# Altium schematic sheet WIZ850io_SCH_V100.SchDoc (part 2 of 3)
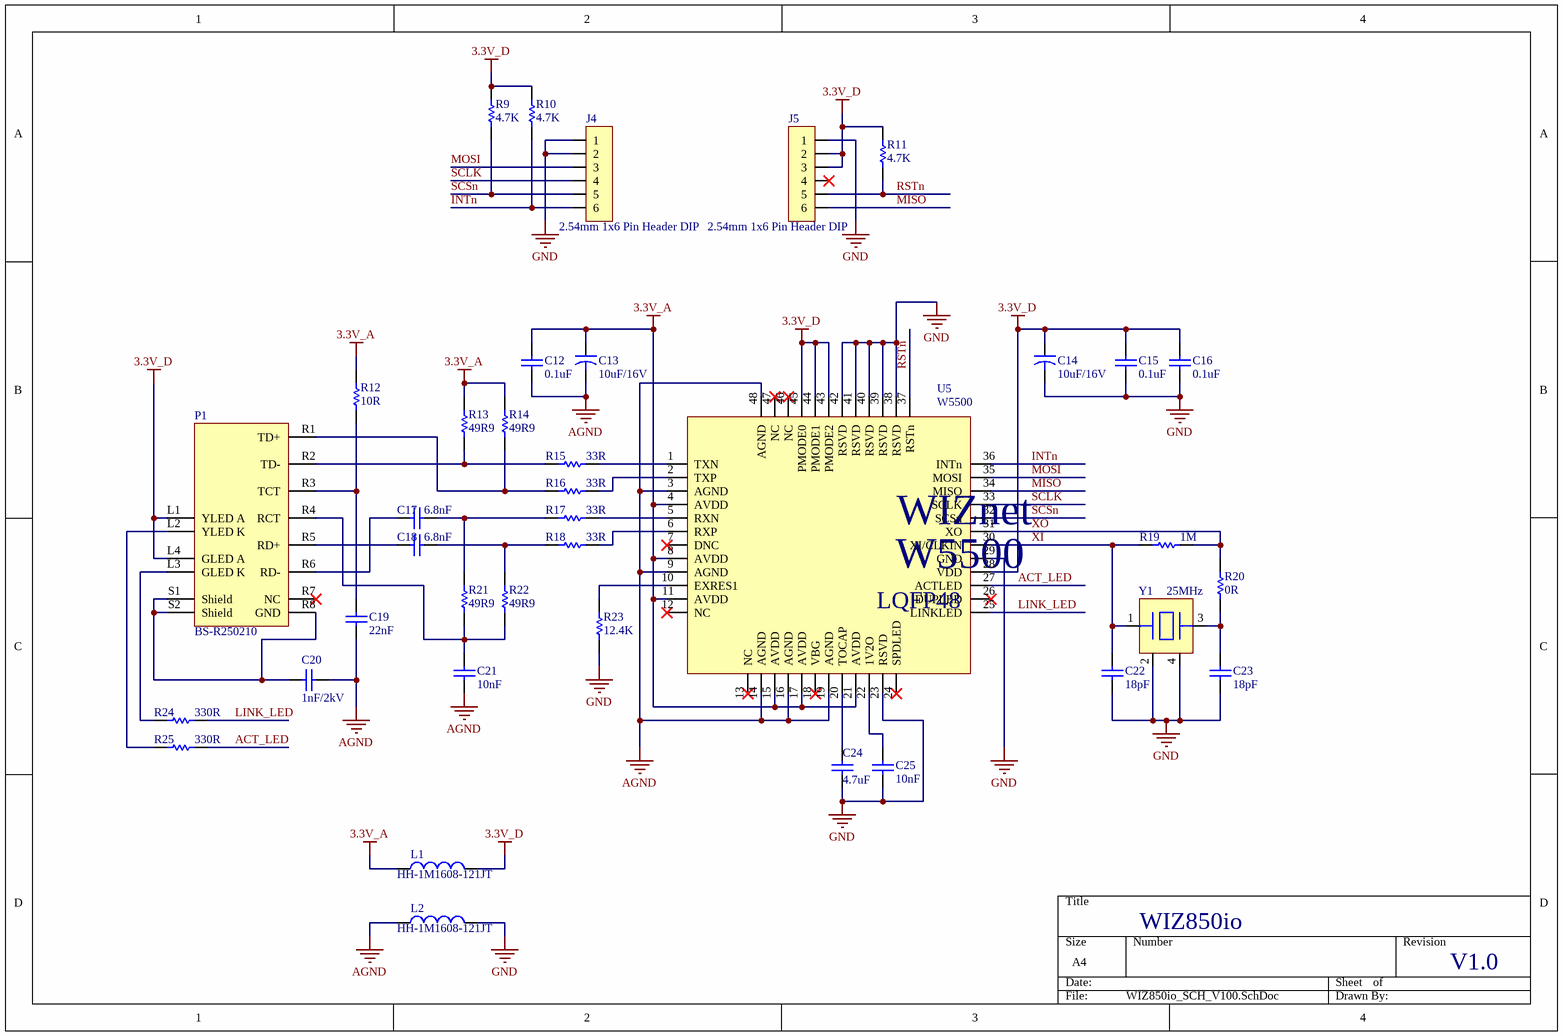
[diagram p1: WIZ850io_SCH_V100.SchDoc]
## Library data of the parts
C12 C15 C16 = CAP-0402: CAP CER 0.1UF 25V X7R 0603; Manufacturer: Kyocera AVX; Manufacturer Part Number: 06033C104JAT2A; Dielectric Material: Ceramic; Capacitance: 100nF; Tolerance: 5%; Supplier 1: Digi-Key; Supplier Part Number 1: 478-3713-1-ND; RoHS: Yes; Category: Ceramic Capacitors; Stock 1: 348868; Pricing 1: 1=0.33000, 10=0.23100, 50=0.16180, 100=0.13870, 500=0.10400, 1000=0.08782 (USD); Mount: Surface Mount,PCB,Through Hole; Case/Package: 0603; Number of Pins: 2; Case Code (Metric): 1608; Case Code (Imperial): 0603; Contact Plating: Tin,Matte; Min Operating Temperature: -55°C; Max Operating Temperature: 125°C; Voltage Rating: 25V; Packaging: Tape and Reel; Package Quantity: 1; Dielectric: X7R; Termination: SMD/SMT; Voltage Rating (DC): 25V; Voltage: 25V; Length: 1.6mm; Height: 0.9mm; Width: 0.032inch; Thickness: 0.035inch; Depth: 0.81mm; Lead Pitch: 5.08mm; Radiation Hardening: No; REACH SVHC: No SVHC; Lead Free: Lead Free; ComponentLink1URL: https://datasheet.ciiva.com/208/cx7r-208464.pdf?src-supplier=Digi-Key; ComponentLink1Description: https://datasheet.ciiva.com/208/cx7r-208464.pdf?src-supplier=Digi-Key; ComponentLink2URL: https://datasheet.ciiva.com/208/cx7r-208465.pdf?src-supplier=Digi-Key; ComponentLink2Description: https://datasheet.ciiva.com/208/cx7r-208465.pdf?src-supplier=Digi-Key; ComponentLink3URL: https://datasheet.ciiva.com/1124/1679506-1124547.pdf?src-supplier=Element14; ComponentLink3Description: https://datasheet.ciiva.com/1124/1679506-1124547.pdf?src-supplier=Element14; ComponentLink4URL: https://datasheet.ciiva.com/1124/1679506-1124548.pdf?src-supplier=Element14; ComponentLink4Description: https://datasheet.ciiva.com/1124/1679506-1124548.pdf?src-supplier=Element14; ComponentLink5URL: https://datasheet.ciiva.com/5423/cx7r-218113-5423653.pdf?src-supplier=Mouser; ComponentLink5Description: https://datasheet.ciiva.com/5423/cx7r-218113-5423653.pdf?src-supplier=Mouser; ComponentLink6URL: https://datasheet.ciiva.com/7855/1679506-7855045.pdf?src-supplier=Element14; ComponentLink6Description: https://datasheet.ciiva.com/7855/1679506-7855045.pdf?src-supplier=Element14; ComponentLink7URL: https://datasheet.ciiva.com/15165/getdatasheetpartid-33578-15165094.pdf?src-supplier=Verical; ComponentLink7Description: https://datasheet.ciiva.com/15165/getdatasheetpartid-33578-15165094.pdf?src-supplier=Verical; ComponentLink8URL: https://datasheet.ciiva.com/2987/cx7r-2987753.pdf?src-supplier=Avnet; ComponentLink8Description: https://datasheet.ciiva.com/2987/cx7r-2987753.pdf?src-supplier=Avnet; ComponentLink9URL: https://datasheet.ciiva.com/14595/70001075-14595082.pdf?src-supplier=Allied+Electronics; ComponentLink9Description: https://datasheet.ciiva.com/14595/70001075-14595082.pdf?src-supplier=Allied+Electronics; ComponentLink10URL: https://datasheet.ciiva.com/14590/70001075-14590332.pdf?src-supplier=Allied+Electronics; ComponentLink10Description: https://datasheet.ciiva.com/14590/70001075-14590332.pdf?src-supplier=Allied+Electronics; ComponentLink11URL: https://datasheet.ciiva.com/208/cx7r-208463.pdf?src-supplier=Digi-Key; ComponentLink11Description: https://datasheet.ciiva.com/208/cx7r-208463.pdf?src-supplier=Digi-Key
C13 C14 = CAP-A Size: Cap Ceramic 10uF 16V X5R 20% SMD 0603 85°C Paper T/R; Manufacturer: Taiyo Yuden; Manufacturer Part Number: EMK107BBJ106MA-T; Supplier 1: Digi-Key; Supplier Part Number 1: 587-3238-6-ND; RoHS: Yes; Category: Ceramic Capacitors; Stock 1: 797251; Pricing 1: 1=0.37000, 10=0.25800, 50=0.18040, 100=0.15460, 500=0.11598, 1000=0.09794 (USD); Mount: Surface Mount; Case/Package: 0603; Case Code (Metric): 1608; Case Code (Imperial): 0603; Min Operating Temperature: -55°C; Max Operating Temperature: 85°C; Tolerance: 20%; Packaging: Tape and Reel; Capacitance: 10uF; Voltage Rating: 16V; Package Quantity: 1; Dielectric: X5R; Voltage Rating (DC): 16V; Termination: SMD/SMT; Length: 0.063inch; Height: 0.8mm; Width: 0.031inch; Thickness: 0.031inch; REACH SVHC: Unknown; Halogen Free: Halogen Free; ComponentLink1URL: https://datasheet.ciiva.com/6259/emk107bbj106ma-t-6259169.pdf?src-supplier=Digi-Key; ComponentLink1Description: https://datasheet.ciiva.com/6259/emk107bbj106ma-t-6259169.pdf?src-supplier=Digi-Key; ComponentLink2URL: https://datasheet.ciiva.com/15920/3emk107bbj106ma-t-15920482.pdf?src-supplier=Onlinecomponents.com; ComponentLink2Description: https://datasheet.ciiva.com/15920/3emk107bbj106ma-t-15920482.pdf?src-supplier=Onlinecomponents.com; ComponentLink3URL: https://datasheet.ciiva.com/34372/463emk107bbj106ma-t-34372674.pdf?src-supplier=Onlinecomponents.com; ComponentLink3Description: https://datasheet.ciiva.com/34372/463emk107bbj106ma-t-34372674.pdf?src-supplier=Onlinecomponents.com; ComponentLink4URL: https://datasheet.ciiva.com/6259/emk107bbj106ma-t-6259164.pdf?src-supplier=Digi-Key; ComponentLink4Description: https://datasheet.ciiva.com/6259/emk107bbj106ma-t-6259164.pdf?src-supplier=Digi-Key; ComponentLink5URL: https://datasheet.ciiva.com/6259/emk107bbj106ma-t-6259167.pdf?src-supplier=Digi-Key; ComponentLink5Description: https://datasheet.ciiva.com/6259/emk107bbj106ma-t-6259167.pdf?src-supplier=Digi-Key; ComponentLink6URL: https://datasheet.ciiva.com/13168/mlcc01-e-13168735.pdf?src-supplier=Mouser; ComponentLink6Description: https://datasheet.ciiva.com/13168/mlcc01-e-13168735.pdf?src-supplier=Mouser
C17 C18 = CAP-0402: AVX - 06031C682KAT2A - SMD Multilayer Ceramic Capacitor, 6800 pF, 100 V, 0603 [1608 Metric], ± 10%, X7R, AVX 0603 MLCC; Manufacturer: Kyocera AVX; Voltage Rating (DC): 100V; Dissipation Factor: 2.5%; Supplier 1: Digi-Key; Supplier Part Number 1: 478-1204-1-ND; Manufacturer Part Number: 06031C682KAT2A; RoHS: Yes; Category: Ceramic Capacitors; Stock 1: 9488; Pricing 1: 1=0.25000, 10=0.17200, 50=0.10340, 100=0.08740, 500=0.05978, 1000=0.05288 (USD); Mount: Surface Mount,PCB; Case/Package: 0603; Number of Pins: 2; Case Code (Metric): 1608; Case Code (Imperial): 0603; Contact Plating: Tin,Matte; Min Operating Temperature: -55°C; Max Operating Temperature: 125°C; Capacitance: 6.8nF; Tolerance: 10%; Packaging: Tape and Reel; Dielectric: X7R; Voltage Rating: 100V; Termination: SMD/SMT; Package Quantity: 1; Voltage: 100V; Length: 1.6mm; Height: 0.9mm; Width: 0.032inch; Depth: 0.81mm; Thickness: 0.035inch; Radiation Hardening: No; Lead Free: Lead Free; REACH SVHC: No SVHC; ComponentLink1URL: https://datasheet.ciiva.com/11788/0900766b80dc2409-11788556.pdf?src-supplier=RSComponents; ComponentLink1Description: https://datasheet.ciiva.com/11788/0900766b80dc2409-11788556.pdf?src-supplier=RSComponents; ComponentLink2URL: https://datasheet.ciiva.com/151/cx7r-151121.pdf?src-supplier=Digi-Key; ComponentLink2Description: https://datasheet.ciiva.com/151/cx7r-151121.pdf?src-supplier=Digi-Key; ComponentLink3URL: https://datasheet.ciiva.com/151/cx7r-151122.pdf?src-supplier=Digi-Key; ComponentLink3Description: https://datasheet.ciiva.com/151/cx7r-151122.pdf?src-supplier=Digi-Key; ComponentLink4URL: https://datasheet.ciiva.com/151/cx7r-151123.pdf?src-supplier=Digi-Key; ComponentLink4Description: https://datasheet.ciiva.com/151/cx7r-151123.pdf?src-supplier=Digi-Key; ComponentLink5URL: https://datasheet.ciiva.com/5417/cx7r-218113-5417925.pdf?src-supplier=Mouser; ComponentLink5Description: https://datasheet.ciiva.com/5417/cx7r-218113-5417925.pdf?src-supplier=Mouser; ComponentLink6URL: https://datasheet.ciiva.com/17489/cx7r-17489445.pdf?src-supplier=Avnet+Europe; ComponentLink6Description: https://datasheet.ciiva.com/17489/cx7r-17489445.pdf?src-supplier=Avnet+Europe; ComponentLink7URL: https://datasheet.ciiva.com/11577/cx7r-11577894.pdf?src-supplier=Avnet; ComponentLink7Description: https://datasheet.ciiva.com/11577/cx7r-11577894.pdf?src-supplier=Avnet; ComponentLink8URL: https://datasheet.ciiva.com/16484/cx7r-16484406.pdf?src-supplier=Avnet+Asia; ComponentLink8Description: https://datasheet.ciiva.com/16484/cx7r-16484406.pdf?src-supplier=Avnet+Asia; ComponentLink9URL: https://datasheet.ciiva.com/1124/1679506-1124359.pdf?src-supplier=Element14; ComponentLink9Description: https://datasheet.ciiva.com/1124/1679506-1124359.pdf?src-supplier=Element14; ComponentLink10URL: https://datasheet.ciiva.com/1124/1679506-1124360.pdf?src-supplier=Element14; ComponentLink10Description: https://datasheet.ciiva.com/1124/1679506-1124360.pdf?src-supplier=Element14; ComponentLink11URL: https://datasheet.ciiva.com/14595/70001075-14595998.pdf?src-supplier=Allied+Electronics; ComponentLink11Description: https://datasheet.ciiva.com/14595/70001075-14595998.pdf?src-supplier=Allied+Electronics; ComponentLink12URL: https://datasheet.ciiva.com/16395/cx7r-16395935.pdf?src-supplier=Future+Electronics; ComponentLink12Description: https://datasheet.ciiva.com/16395/cx7r-16395935.pdf?src-supplier=Future+Electronics
C19 = CAP-0402: Cap Ceramic 0.022uF 25V X7R 10% SMD 0603 125°C Paper T/R; Manufacturer: Kyocera AVX; Manufacturer Part Number: 06033C223KAT2A; Supplier 1: Digi-Key; Supplier Part Number 1: 478-5896-1-ND; RoHS: Yes; Category: Ceramic Capacitors; Stock 1: 466; Pricing 1: 1=0.12000, 10=0.08500, 50=0.04820, 100=0.04000, 500=0.02804, 1000=0.02322 (USD); Mount: Surface Mount; Case/Package: 0603; Number of Pins: 2; Case Code (Imperial): 0603; Case Code (Metric): 1608; Dielectric Material: Ceramic; Contact Plating: Tin,Matte; Min Operating Temperature: -55°C; Max Operating Temperature: 125°C; Capacitance: 22nF; Tolerance: 10%; Voltage Rating: 25V; Dielectric: X7R; Packaging: Tape and Reel; Voltage Rating (DC): 25V; Termination: SMD/SMT; Package Quantity: 1; Voltage: 25V; Length: 1.6mm; Height: 0.9mm; Width: 0.032inch; Depth: 0.81mm; Thickness: 0.035inch; Radiation Hardening: No; Lead Free: Lead Free; REACH SVHC: Unknown; ComponentLink1URL: https://datasheet.ciiva.com/11787/0900766b802d4698-11787397.pdf?src-supplier=RSComponents; ComponentLink1Description: https://datasheet.ciiva.com/11787/0900766b802d4698-11787397.pdf?src-supplier=RSComponents; ComponentLink2URL: https://datasheet.ciiva.com/1124/1679506-1124596.pdf?src-supplier=Element14; ComponentLink2Description: https://datasheet.ciiva.com/1124/1679506-1124596.pdf?src-supplier=Element14; ComponentLink3URL: https://datasheet.ciiva.com/1124/1679506-1124597.pdf?src-supplier=Element14; ComponentLink3Description: https://datasheet.ciiva.com/1124/1679506-1124597.pdf?src-supplier=Element14; ComponentLink4URL: https://datasheet.ciiva.com/7855/1679506-7855047.pdf?src-supplier=Element14; ComponentLink4Description: https://datasheet.ciiva.com/7855/1679506-7855047.pdf?src-supplier=Element14; ComponentLink5URL: https://datasheet.ciiva.com/5419/cx7r-5419880.pdf?src-supplier=Mouser; ComponentLink5Description: https://datasheet.ciiva.com/5419/cx7r-5419880.pdf?src-supplier=Mouser; ComponentLink6URL: https://datasheet.ciiva.com/161/cx7r-161997.pdf?src-supplier=Digi-Key; ComponentLink6Description: https://datasheet.ciiva.com/161/cx7r-161997.pdf?src-supplier=Digi-Key; ComponentLink7URL: https://datasheet.ciiva.com/161/cx7r-161998.pdf?src-supplier=Digi-Key; ComponentLink7Description: https://datasheet.ciiva.com/161/cx7r-161998.pdf?src-supplier=Digi-Key; ComponentLink8URL: https://datasheet.ciiva.com/16225/cx7r-16225742.pdf?src-supplier=Future+Electronics; ComponentLink8Description: https://datasheet.ciiva.com/16225/cx7r-16225742.pdf?src-supplier=Future+Electronics; ComponentLink9URL: https://datasheet.ciiva.com/161/cx7r-161999.pdf?src-supplier=Digi-Key; ComponentLink9Description: https://datasheet.ciiva.com/161/cx7r-161999.pdf?src-supplier=Digi-Key
C20 = CAP-1808: Cap Ceramic 0.001uF 50V X7R 10% SMD 0603 125C Paper T/R; Manufacturer: Kyocera AVX; Manufacturer Part Number: 06035C102KAT2A; Capacitance: 1nF; Supplier 1: Digi-Key; Supplier Part Number 1: 478-1215-1-ND; RoHS: Yes; Category: Ceramic Capacitors; Stock 1: 1212280; Pricing 1: 1=0.10000, 10=0.06100, 50=0.03340, 100=0.02730, 500=0.01948, 1000=0.01531 (USD); Mount: Surface Mount,PCB; Case/Package: 0603; Number of Pins: 2; Weight: 7.1E-05oz; Case Code (Imperial): 0603; Case Code (Metric): 1608; Dielectric Material: Ceramic; Contact Plating: Tin,Matte; Min Operating Temperature: -55°C; Max Operating Temperature: 125°C; Tolerance: 10%; Voltage Rating: 50V; Packaging: Tape and Reel; Dielectric: X7R; Voltage Rating (DC): 50V; Package Quantity: 4000; Termination: SMD/SMT; Voltage: 50V; Length: 1.6mm; Height: 0.9mm; Width: 0.81mm; Thickness: 0.035inch; Depth: 0.81mm; Radiation Hardening: No; REACH SVHC: No SVHC; Lead Free: Lead Free; ComponentLink1URL: https://datasheet.ciiva.com/11787/0900766b802d4698-11787050.pdf?src-supplier=RSComponents; ComponentLink1Description: https://datasheet.ciiva.com/11787/0900766b802d4698-11787050.pdf?src-supplier=RSComponents; ComponentLink2URL: https://datasheet.ciiva.com/1124/1679506-1124840.pdf?src-supplier=Element14; ComponentLink2Description: https://datasheet.ciiva.com/1124/1679506-1124840.pdf?src-supplier=Element14; ComponentLink3URL: https://datasheet.ciiva.com/7855/1679506-7855080.pdf?src-supplier=Element14; ComponentLink3Description: https://datasheet.ciiva.com/7855/1679506-7855080.pdf?src-supplier=Element14; ComponentLink4URL: https://datasheet.ciiva.com/2987/cx7r-2987820.pdf?src-supplier=Avnet; ComponentLink4Description: https://datasheet.ciiva.com/2987/cx7r-2987820.pdf?src-supplier=Avnet; ComponentLink5URL: https://datasheet.ciiva.com/150/cx7r-150237.pdf?src-supplier=Digi-Key; ComponentLink5Description: https://datasheet.ciiva.com/150/cx7r-150237.pdf?src-supplier=Digi-Key; ComponentLink6URL: https://datasheet.ciiva.com/16327/cx7r-16327069.pdf?src-supplier=Future+Electronics; ComponentLink6Description: https://datasheet.ciiva.com/16327/cx7r-16327069.pdf?src-supplier=Future+Electronics; ComponentLink7URL: https://datasheet.ciiva.com/16538/cx7r-16538173.pdf?src-supplier=Avnet+Asia; ComponentLink7Description: https://datasheet.ciiva.com/16538/cx7r-16538173.pdf?src-supplier=Avnet+Asia; ComponentLink8URL: https://datasheet.ciiva.com/1124/1679506-1124839.pdf?src-supplier=Element14; ComponentLink8Description: https://datasheet.ciiva.com/1124/1679506-1124839.pdf?src-supplier=Element14; ComponentLink9URL: https://datasheet.ciiva.com/14595/70001075-14595287.pdf?src-supplier=Allied+Electronics; ComponentLink9Description: https://datasheet.ciiva.com/14595/70001075-14595287.pdf?src-supplier=Allied+Electronics; ComponentLink10URL: https://datasheet.ciiva.com/2987/cx7r-2987819.pdf?src-supplier=Avnet; ComponentLink10Description: https://datasheet.ciiva.com/2987/cx7r-2987819.pdf?src-supplier=Avnet; ComponentLink11URL: https://datasheet.ciiva.com/150/cx7r-150236.pdf?src-supplier=Digi-Key; ComponentLink11Description: https://datasheet.ciiva.com/150/cx7r-150236.pdf?src-supplier=Digi-Key; ComponentLink12URL: https://datasheet.ciiva.com/150/cx7r-150238.pdf?src-supplier=Digi-Key; ComponentLink12Description: https://datasheet.ciiva.com/150/cx7r-150238.pdf?src-supplier=Digi-Key
C21 = CAP-0402: 0603 10nF 50 V ±10 % Tolerance X7R Surface Mount Multilayer Ceramic Capacitor; Manufacturer: Kyocera AVX; Manufacturer Part Number: 06035C103KAT2A; Tolerance: 10%; Voltage Rating (DC): 50V; Dissipation Factor: 2.5%; Insulation Resistance: 100GR; Supplier 1: Digi-Key; Supplier Part Number 1: 478-1227-1-ND; RoHS: Yes; Category: Ceramic Capacitors; Stock 1: 9754114; Pricing 1: 1=0.10000, 10=0.04300, 50=0.02320, 100=0.01900, 500=0.01356, 1000=0.01065 (USD); Mount: Surface Mount,PCB; Case/Package: 0603; Number of Pins: 2; Case Code (Metric): 1608; Case Code (Imperial): 0603; Dielectric Material: Ceramic; Contact Plating: Tin,Matte; Min Operating Temperature: -55°C; Max Operating Temperature: 125°C; Capacitance: 10nF; Dielectric: X7R; Voltage Rating: 50V; Packaging: Tape and Reel; Package Quantity: 1; Termination: SMD/SMT; Voltage: 50V; Length: 1.6mm; Height: 0.9mm; Width: 0.032inch; Depth: 0.81mm; Thickness: 0.035inch; Radiation Hardening: No; Lead Free: Lead Free; REACH SVHC: No SVHC; ComponentLink1URL: https://datasheet.ciiva.com/1124/1679506-1124848.pdf?src-supplier=Element14; ComponentLink1Description: https://datasheet.ciiva.com/1124/1679506-1124848.pdf?src-supplier=Element14; ComponentLink2URL: https://datasheet.ciiva.com/150/cx7r-150227.pdf?src-supplier=Digi-Key; ComponentLink2Description: https://datasheet.ciiva.com/150/cx7r-150227.pdf?src-supplier=Digi-Key; ComponentLink3URL: https://datasheet.ciiva.com/2987/cx7r-2987824.pdf?src-supplier=Avnet; ComponentLink3Description: https://datasheet.ciiva.com/2987/cx7r-2987824.pdf?src-supplier=Avnet; ComponentLink4URL: https://datasheet.ciiva.com/150/cx7r-150229.pdf?src-supplier=Digi-Key; ComponentLink4Description: https://datasheet.ciiva.com/150/cx7r-150229.pdf?src-supplier=Digi-Key; ComponentLink5URL: https://datasheet.ciiva.com/7855/1679506-7855082.pdf?src-supplier=Element14; ComponentLink5Description: https://datasheet.ciiva.com/7855/1679506-7855082.pdf?src-supplier=Element14
C22 C23 = CAP-0402: AVX - 06031A180JAT2A - SMD Multilayer Ceramic Capacitor, 18 pF, 100 V, 0603 [1608 Metric], ± 5%, C0G / NP0; Manufacturer: Kyocera AVX; Voltage Rating: 100V; Temperature Coefficient: 30ppm/°C; Insulation Resistance: 100GR; Supplier 1: Digi-Key; Supplier Part Number 1: 478-4982-1-ND; Manufacturer Part Number: 06031A180JAT2A; RoHS: Yes; Category: Ceramic Capacitors; Stock 1: 6208; Pricing 1: 1=0.17000, 10=0.12300, 50=0.06980, 100=0.05790, 500=0.04060, 1000=0.03361 (USD); Mount: Surface Mount,PCB; Case/Package: 0603; Number of Pins: 2; Case Code (Metric): 1608; Case Code (Imperial): 0603; Dielectric Material: Ceramic; Contact Plating: Tin,Matte; Min Operating Temperature: -55°C; Max Operating Temperature: 125°C; Capacitance: 18pF; Tolerance: 5%; Packaging: Tape and Reel; Dielectric: C0G; Package Quantity: 4000; Voltage Rating (DC): 100V; Termination: SMD/SMT; Voltage: 100V; Length: 1.6mm; Height: 0.9mm; Width: 0.032inch; Depth: 0.81mm; Thickness: 0.035inch; Radiation Hardening: No; Lead Free: Lead Free; REACH SVHC: No SVHC; ComponentLink1URL: https://datasheet.ciiva.com/150/ccog-150800.pdf?src-supplier=Digi-Key; ComponentLink1Description: https://datasheet.ciiva.com/150/ccog-150800.pdf?src-supplier=Digi-Key; ComponentLink2URL: https://datasheet.ciiva.com/1124/759117-1124128.pdf?src-supplier=Element14; ComponentLink2Description: https://datasheet.ciiva.com/1124/759117-1124128.pdf?src-supplier=Element14; ComponentLink3URL: https://datasheet.ciiva.com/150/ccog-150801.pdf?src-supplier=Digi-Key; ComponentLink3Description: https://datasheet.ciiva.com/150/ccog-150801.pdf?src-supplier=Digi-Key; ComponentLink4URL: https://datasheet.ciiva.com/150/ccog-150802.pdf?src-supplier=Digi-Key; ComponentLink4Description: https://datasheet.ciiva.com/150/ccog-150802.pdf?src-supplier=Digi-Key; ComponentLink5URL: https://datasheet.ciiva.com/16297/ccog-16297640.pdf?src-supplier=Future+Electronics; ComponentLink5Description: https://datasheet.ciiva.com/16297/ccog-16297640.pdf?src-supplier=Future+Electronics; ComponentLink6URL: https://datasheet.ciiva.com/11499/ccog-11499641.pdf?src-supplier=Avnet; ComponentLink6Description: https://datasheet.ciiva.com/11499/ccog-11499641.pdf?src-supplier=Avnet; ComponentLink7URL: https://datasheet.ciiva.com/5414/ccog-5414522.pdf?src-supplier=Mouser; ComponentLink7Description: https://datasheet.ciiva.com/5414/ccog-5414522.pdf?src-supplier=Mouser; ComponentLink8URL: https://datasheet.ciiva.com/1124/759117-1124127.pdf?src-supplier=Element14; ComponentLink8Description: https://datasheet.ciiva.com/1124/759117-1124127.pdf?src-supplier=Element14; ComponentLink9URL: https://datasheet.ciiva.com/28689/759117-28689519.pdf?src-supplier=Element14; ComponentLink9Description: https://datasheet.ciiva.com/28689/759117-28689519.pdf?src-supplier=Element14
C24 = CAP-0402: Ceramic CAP 0402(1005)
C25 = CAP-0805: 0603 10nF 50 V ±10 % Tolerance X7R Surface Mount Multilayer Ceramic Capacitor; Manufacturer: Kyocera AVX; Manufacturer Part Number: 06035C103KAT2A; Tolerance: 10%; Voltage Rating (DC): 50V; Dissipation Factor: 2.5%; Insulation Resistance: 100GR; Supplier 1: Digi-Key; Supplier Part Number 1: 478-1227-1-ND; RoHS: Yes; Category: Ceramic Capacitors; Stock 1: 9754114; Pricing 1: 1=0.10000, 10=0.04300, 50=0.02320, 100=0.01900, 500=0.01356, 1000=0.01065 (USD); Mount: Surface Mount,PCB; Case/Package: 0603; Number of Pins: 2; Case Code (Metric): 1608; Case Code (Imperial): 0603; Dielectric Material: Ceramic; Contact Plating: Tin,Matte; Min Operating Temperature: -55°C; Max Operating Temperature: 125°C; Capacitance: 10nF; Dielectric: X7R; Voltage Rating: 50V; Packaging: Tape and Reel; Package Quantity: 1; Termination: SMD/SMT; Voltage: 50V; Length: 1.6mm; Height: 0.9mm; Width: 0.032inch; Depth: 0.81mm; Thickness: 0.035inch; Radiation Hardening: No; Lead Free: Lead Free; REACH SVHC: No SVHC; ComponentLink1URL: https://datasheet.ciiva.com/1124/1679506-1124848.pdf?src-supplier=Element14; ComponentLink1Description: https://datasheet.ciiva.com/1124/1679506-1124848.pdf?src-supplier=Element14; ComponentLink2URL: https://datasheet.ciiva.com/2987/cx7r-2987824.pdf?src-supplier=Avnet; ComponentLink2Description: https://datasheet.ciiva.com/2987/cx7r-2987824.pdf?src-supplier=Avnet; ComponentLink3URL: https://datasheet.ciiva.com/150/cx7r-150227.pdf?src-supplier=Digi-Key; ComponentLink3Description: https://datasheet.ciiva.com/150/cx7r-150227.pdf?src-supplier=Digi-Key; ComponentLink4URL: https://datasheet.ciiva.com/150/cx7r-150229.pdf?src-supplier=Digi-Key; ComponentLink4Description: https://datasheet.ciiva.com/150/cx7r-150229.pdf?src-supplier=Digi-Key; ComponentLink5URL: https://datasheet.ciiva.com/7855/1679506-7855082.pdf?src-supplier=Element14; ComponentLink5Description: https://datasheet.ciiva.com/7855/1679506-7855082.pdf?src-supplier=Element14
L1 L2 = IND-0603: Inductor 0603(1608)
R9 R10 = RES-0402: SMD Resistor, Thick film 4.7 kOhm,  ±  1 %, 0603, CRCW06034K70FKEA, Vishay; Manufacturer: Vishay Dale; Manufacturer Part Number: CRA06S0434K70JTA; Resistance: 4.7kR; Tolerance: 5%; Number of Contacts: 4; Voltage Rating (DC): 50V; Circuit Type: Isolated; Number of Resistors: 2; Power Per Element: 62.5mW; Temperature Coefficient: 200ppm/°C; Power Rating: 100mW; Voltage Rating: 75V; Supplier 1: Arrow; Supplier Part Number 1: CRA06S0434K70JTA; RoHS: Yes; Category: Resistor Arrays; Mount: Surface Mount; Case/Package: SMD/SMT; Number of Pins: 4; Case Code (Metric): 1615; Contact Plating: Tin; Case Code (Imperial): 0605; Min Operating Temperature: -55°C; Max Operating Temperature: 155°C; Packaging: Tape and Reel; Package Quantity: 5000; Termination: SMD/SMT; Length: 1.6mm; Height: 0.024inch; Width: 0.059inch; Thickness: 500um; Terminal Pitch: 0.8mm; Lead Pitch: 0.8mm; Lead Free: Exempt; ComponentLink1URL: https://datasheet.ciiva.com/2697/cra06es-2697298.pdf?src-supplier=Digi-Key; ComponentLink1Description: https://datasheet.ciiva.com/2697/cra06es-2697298.pdf?src-supplier=Digi-Key; ComponentLink2URL: https://datasheet.ciiva.com/2697/cra06es-2697299.pdf?src-supplier=Digi-Key; ComponentLink2Description: https://datasheet.ciiva.com/2697/cra06es-2697299.pdf?src-supplier=Digi-Key; ComponentLink3URL: https://datasheet.ciiva.com/2697/cra06es-2697300.pdf?src-supplier=Digi-Key; ComponentLink3Description: https://datasheet.ciiva.com/2697/cra06es-2697300.pdf?src-supplier=Digi-Key; Supplier 2: Digi-Key; Supplier Part Number 2: 541-4.70KHCT-ND; Stock 2: 40363; Pricing 2: 1=0.10000, 10=0.03400, 100=0.01390, 1000=0.00623, 2500=0.00540 (USD); Weight: 7.1E-05oz; Composition: Thick Film; Military Standard: Not; Depth: 0.85mm; REACH SVHC: Unknown; ComponentLink4URL: https://datasheet.ciiva.com/11809/0900766b80d98afc-11809859.pdf?src-supplier=RSComponents; ComponentLink4Description: https://datasheet.ciiva.com/11809/0900766b80d98afc-11809859.pdf?src-supplier=RSComponents; ComponentLink5URL: https://datasheet.ciiva.com/16199/dcrcwe3-16199366.pdf?src-supplier=Future+Electronics; ComponentLink5Description: https://datasheet.ciiva.com/16199/dcrcwe3-16199366.pdf?src-supplier=Future+Electronics; ComponentLink6URL: https://datasheet.ciiva.com/16764/70201119-16764918.pdf?src-supplier=Allied+Electronics; ComponentLink6Description: https://datasheet.ciiva.com/16764/70201119-16764918.pdf?src-supplier=Allied+Electronics; ComponentLink7URL: https://datasheet.ciiva.com/16520/dcrcwe3-16520616.pdf?src-supplier=Avnet+Asia; ComponentLink7Description: https://datasheet.ciiva.com/16520/dcrcwe3-16520616.pdf?src-supplier=Avnet+Asia; ComponentLink8URL: https://datasheet.ciiva.com/15159/getdatasheetpartid-33073-15159382.pdf?src-supplier=Verical; ComponentLink8Description: https://datasheet.ciiva.com/15159/getdatasheetpartid-33073-15159382.pdf?src-supplier=Verical; ComponentLink9URL: https://datasheet.ciiva.com/16724/70201119-16724106.pdf?src-supplier=Allied+Electronics; ComponentLink9Description: https://datasheet.ciiva.com/16724/70201119-16724106.pdf?src-supplier=Allied+Electronics; ComponentLink10URL: https://datasheet.ciiva.com/8079/1697337-8079646.pdf?src-supplier=Element14; ComponentLink10Description: https://datasheet.ciiva.com/8079/1697337-8079646.pdf?src-supplier=Element14; ComponentLink11URL: https://datasheet.ciiva.com/26314/fld-crcw-e3-data-en-26314735.pdf?src-supplier=Distrelec; ComponentLink11Description: https://datasheet.ciiva.com/26314/fld-crcw-e3-data-en-26314735.pdf?src-supplier=Distrelec
R11 = RES-0402: SMD Resistor, Thick film 4.7 kOhm,  ±  1 %, 0603, CRCW06034K70FKEA, Vishay; Manufacturer Part Number: CRCW12064K70FKEA; Tolerance: 1%; Resistance: 4.7kR; Power Rating: 250mW; Voltage Rating: 200V; Temperature Coefficient: 100ppm/°C; Supplier 1: Digi-Key; Supplier Part Number 1: 541-4.70KFCT-ND; Manufacturer: Vishay; RoHS: Yes; Category: Chip SMD Resistors; Stock 1: 168936; Pricing 1: 1=0.10000, 10=0.07600, 100=0.02930, 1000=0.01287, 2500=0.01112 (USD); Mount: Surface Mount; Case/Package: 1206; Weight: 0.000353oz; Case Code (Imperial): 1206; Case Code (Metric): 3216; Contact Plating: Tin; Min Operating Temperature: -55°C; Max Operating Temperature: 155°C; Packaging: Tape and Reel; Composition: Thick Film; Military Standard: Not; Package Quantity: 10; Termination: SMD/SMT; Voltage Rating (DC): 200V; Number of Terminations: 2; Max Power Dissipation: 250mW; Features: Automotive AEC-Q200; Length: 3.2mm; Height: 0.55mm; Width: 1.6mm; Depth: 1.6mm; Radiation Hardening: No; REACH SVHC: Unknown; Lead Free: Lead Free; ComponentLink1URL: https://datasheet.ciiva.com/11809/0900766b80d98b5e-11809114.pdf?src-supplier=RSComponents; ComponentLink1Description: https://datasheet.ciiva.com/11809/0900766b80d98b5e-11809114.pdf?src-supplier=RSComponents; ComponentLink2URL: https://datasheet.ciiva.com/8079/1720486-8079670.pdf?src-supplier=Element14; ComponentLink2Description: https://datasheet.ciiva.com/8079/1720486-8079670.pdf?src-supplier=Element14; ComponentLink3URL: https://datasheet.ciiva.com/16724/70201119-16724102.pdf?src-supplier=Allied+Electronics; ComponentLink3Description: https://datasheet.ciiva.com/16724/70201119-16724102.pdf?src-supplier=Allied+Electronics; ComponentLink4URL: https://datasheet.ciiva.com/8079/1697337-8079656.pdf?src-supplier=Element14; ComponentLink4Description: https://datasheet.ciiva.com/8079/1697337-8079656.pdf?src-supplier=Element14; ComponentLink5URL: https://datasheet.ciiva.com/9071/dcrcwe3-9071209.pdf?src-supplier=Avnet; ComponentLink5Description: https://datasheet.ciiva.com/9071/dcrcwe3-9071209.pdf?src-supplier=Avnet; ComponentLink6URL: https://datasheet.ciiva.com/16201/dcrcwe3-16201466.pdf?src-supplier=Future+Electronics; ComponentLink6Description: https://datasheet.ciiva.com/16201/dcrcwe3-16201466.pdf?src-supplier=Future+Electronics; ComponentLink7URL: https://datasheet.ciiva.com/17196/dcrcwe3-17196138.pdf?src-supplier=Avnet+Europe; ComponentLink7Description: https://datasheet.ciiva.com/17196/dcrcwe3-17196138.pdf?src-supplier=Avnet+Europe; ComponentLink8URL: https://datasheet.ciiva.com/26316/fld-crcw-e3-data-en-26316458.pdf?src-supplier=Distrelec; ComponentLink8Description: https://datasheet.ciiva.com/26316/fld-crcw-e3-data-en-26316458.pdf?src-supplier=Distrelec; ComponentLink9URL: https://datasheet.ciiva.com/2526/dcrcwe3-2526667.pdf?src-supplier=Digi-Key; ComponentLink9Description: https://datasheet.ciiva.com/2526/dcrcwe3-2526667.pdf?src-supplier=Digi-Key; ComponentLink10URL: https://datasheet.ciiva.com/2526/dcrcwe3-2526668.pdf?src-supplier=Digi-Key; ComponentLink10Description: https://datasheet.ciiva.com/2526/dcrcwe3-2526668.pdf?src-supplier=Digi-Key; ComponentLink11URL: https://datasheet.ciiva.com/2526/dcrcwe3-2526669.pdf?src-supplier=Digi-Key; ComponentLink11Description: https://datasheet.ciiva.com/2526/dcrcwe3-2526669.pdf?src-supplier=Digi-Key; Supplier 2: Arrow; Supplier Part Number 2: CRA06S0434K70JTA; Supplier 3: Digi-Key; Supplier Part Number 3: 541-4.70KHCT-ND; Stock 3: 40363; Pricing 3: 1=0.10000, 10=0.03400, 100=0.01390, 1000=0.00623, 2500=0.00540 (USD); ComponentLink12URL: https://datasheet.ciiva.com/11809/0900766b80d98afc-11809859.pdf?src-supplier=RSComponents; ComponentLink12Description: https://datasheet.ciiva.com/11809/0900766b80d98afc-11809859.pdf?src-supplier=RSComponents; ComponentLink13URL: https://datasheet.ciiva.com/16199/dcrcwe3-16199366.pdf?src-supplier=Future+Electronics; ComponentLink13Description: https://datasheet.ciiva.com/16199/dcrcwe3-16199366.pdf?src-supplier=Future+Electronics; ComponentLink14URL: https://datasheet.ciiva.com/16764/70201119-16764918.pdf?src-supplier=Allied+Electronics; ComponentLink14Description: https://datasheet.ciiva.com/16764/70201119-16764918.pdf?src-supplier=Allied+Electronics; ComponentLink15URL: https://datasheet.ciiva.com/16520/dcrcwe3-16520616.pdf?src-supplier=Avnet+Asia; ComponentLink15Description: https://datasheet.ciiva.com/16520/dcrcwe3-16520616.pdf?src-supplier=Avnet+Asia; ComponentLink16URL: https://datasheet.ciiva.com/15159/getdatasheetpartid-33073-15159382.pdf?src-supplier=Verical; ComponentLink16Description: https://datasheet.ciiva.com/15159/getdatasheetpartid-33073-15159382.pdf?src-supplier=Verical; ComponentLink17URL: https://datasheet.ciiva.com/16724/70201119-16724106.pdf?src-supplier=Allied+Electronics; ComponentLink17Description: https://datasheet.ciiva.com/16724/70201119-16724106.pdf?src-supplier=Allied+Electronics; ComponentLink18URL: https://datasheet.ciiva.com/8079/1697337-8079646.pdf?src-supplier=Element14; ComponentLink18Description: https://datasheet.ciiva.com/8079/1697337-8079646.pdf?src-supplier=Element14; ComponentLink19URL: https://datasheet.ciiva.com/26314/fld-crcw-e3-data-en-26314735.pdf?src-supplier=Distrelec; ComponentLink19Description: https://datasheet.ciiva.com/26314/fld-crcw-e3-data-en-26314735.pdf?src-supplier=Distrelec
R12 = RES-0402: Res Thick Film 0603 10 Ohm 1% 1/10W ±100ppm/°C Molded SMD Paper T/R; Manufacturer: Vishay Dale; Manufacturer Part Number: CRA06S04310R0JTA; Circuit Type: Isolated; Number of Resistors: 2; Power Per Element: 62.5mW; Temperature Coefficient: 200ppm/°C; Number of Contacts: 4; Voltage Rating (DC): 50V; Tolerance: 5%; Power Rating: 100mW; Voltage Rating: 75V; Supplier 1: Avnet; Supplier Part Number 1: CRA06S04310R0JTA; RoHS: Yes; Category: Resistor Arrays; Mount: Surface Mount; Case/Package: SMD/SMT; Number of Pins: 4; Contact Plating: Tin; Case Code (Imperial): 0605; Case Code (Metric): 1615; Min Operating Temperature: -55°C; Max Operating Temperature: 155°C; Termination: Convex; Package Quantity: 5000; Resistance: 10R; Packaging: Tape and Reel; Length: 0.063inch; Height: 0.024inch; Terminal Pitch: 0.8mm; Thickness: 500um; Width: 0.059inch; Lead Free: Exempt; ComponentLink1URL: https://datasheet.ciiva.com/2697/cra06es-2697233.pdf?src-supplier=Digi-Key; ComponentLink1Description: https://datasheet.ciiva.com/2697/cra06es-2697233.pdf?src-supplier=Digi-Key; ComponentLink2URL: https://datasheet.ciiva.com/2697/cra06es-2697234.pdf?src-supplier=Digi-Key; ComponentLink2Description: https://datasheet.ciiva.com/2697/cra06es-2697234.pdf?src-supplier=Digi-Key; ComponentLink3URL: https://datasheet.ciiva.com/2697/cra06es-2697232.pdf?src-supplier=Digi-Key; ComponentLink3Description: https://datasheet.ciiva.com/2697/cra06es-2697232.pdf?src-supplier=Digi-Key; Supplier 2: Avnet; Supplier Part Number 2: CRCW060310R0FKEA; Stock 2: 1240000; Pricing 2: 5000=0.00192, 10000=0.00189, 20000=0.00184, 30000=0.00180, 40000=0.00173 (USD); Weight: 7.1E-05oz; Composition: Thick Film; Number of Terminations: 2; Max Power Dissipation: 100mW; Military Standard: Not; Features: Automotive AEC-Q200; Depth: 0.85mm; REACH SVHC: Unknown; ComponentLink4URL: https://datasheet.ciiva.com/11808/0900766b80d98afc-11808660.pdf?src-supplier=RSComponents; ComponentLink4Description: https://datasheet.ciiva.com/11808/0900766b80d98afc-11808660.pdf?src-supplier=RSComponents; ComponentLink5URL: https://datasheet.ciiva.com/22673/1697337-22673071.pdf?src-supplier=Element14; ComponentLink5Description: https://datasheet.ciiva.com/22673/1697337-22673071.pdf?src-supplier=Element14; ComponentLink6URL: https://datasheet.ciiva.com/2465/dcrcwe3-2465700.pdf?src-supplier=Digi-Key; ComponentLink6Description: https://datasheet.ciiva.com/2465/dcrcwe3-2465700.pdf?src-supplier=Digi-Key; ComponentLink7URL: https://datasheet.ciiva.com/2465/dcrcwe3-2465701.pdf?src-supplier=Digi-Key; ComponentLink7Description: https://datasheet.ciiva.com/2465/dcrcwe3-2465701.pdf?src-supplier=Digi-Key; ComponentLink8URL: https://datasheet.ciiva.com/16740/dcrcwe3-16740661.pdf?src-supplier=Future+Electronics; ComponentLink8Description: https://datasheet.ciiva.com/16740/dcrcwe3-16740661.pdf?src-supplier=Future+Electronics; ComponentLink9URL: https://datasheet.ciiva.com/2465/dcrcwe3-2465699.pdf?src-supplier=Digi-Key; ComponentLink9Description: https://datasheet.ciiva.com/2465/dcrcwe3-2465699.pdf?src-supplier=Digi-Key; ComponentLink10URL: https://datasheet.ciiva.com/5547/dcrcwe3-109170-5547342.pdf?src-supplier=Mouser; ComponentLink10Description: https://datasheet.ciiva.com/5547/dcrcwe3-109170-5547342.pdf?src-supplier=Mouser; ComponentLink11URL: https://datasheet.ciiva.com/3256/dcrcwe3-3256955.pdf?src-supplier=Avnet; ComponentLink11Description: https://datasheet.ciiva.com/3256/dcrcwe3-3256955.pdf?src-supplier=Avnet; ComponentLink12URL: https://datasheet.ciiva.com/26316/fld-crcw-e3-data-en-26316582.pdf?src-supplier=Distrelec; ComponentLink12Description: https://datasheet.ciiva.com/26316/fld-crcw-e3-data-en-26316582.pdf?src-supplier=Distrelec; ComponentLink13URL: https://datasheet.ciiva.com/16781/70201119-16781847.pdf?src-supplier=Allied+Electronics; ComponentLink13Description: https://datasheet.ciiva.com/16781/70201119-16781847.pdf?src-supplier=Allied+Electronics
R13 R14 R21 R22 = RES-0402: VISHAY - TNPW060349R9BEEA. - TNPW0603 49R9 0.1% T-9 ET1 E3 ROHS COMPLIANT: YES; Manufacturer: Vishay Dale; Manufacturer Part Number: CRA06S04349R9FTA; Resistance: 49.9R; Tolerance: 1%; Circuit Type: Isolated; Number of Resistors: 2; Power Per Element: 62.5mW; Temperature Coefficient: 100ppm/°C; Power Rating: 100mW; Voltage Rating: 50V; Working Voltage: 75V; Supplier 1: Arrow; Supplier Part Number 1: CRA06S04349R9FTA; RoHS: Yes; Category: Resistor Arrays; Mount: Surface Mount; Case/Package: SMD/SMT; Number of Pins: 4; Contact Plating: Tin; Min Operating Temperature: -55°C; Max Operating Temperature: 155°C; Packaging: Tape and Reel; Package Quantity: 5000; Termination: Convex; Length: 0.063inch; Height: 0.024inch; Width: 0.059inch; Terminal Pitch: 0.8mm; ComponentLink1URL: https://datasheet.ciiva.com/8318/cra06es-8318680.pdf?src-supplier=Avnet; ComponentLink1Description: https://datasheet.ciiva.com/8318/cra06es-8318680.pdf?src-supplier=Avnet; ComponentLink2URL: https://datasheet.ciiva.com/2699/cra06es-2699211.pdf?src-supplier=Digi-Key; ComponentLink2Description: https://datasheet.ciiva.com/2699/cra06es-2699211.pdf?src-supplier=Digi-Key; Supplier 2: Digi-Key; Supplier Part Number 2: 541-2031-1-ND; Stock 2: 6919; Pricing 2: 1=0.70000, 10=0.51400, 100=0.29950, 1000=0.16795, 2500=0.16456 (USD); Weight: 7.1E-05oz; Case Code (Imperial): 0603; Case Code (Metric): 1608; Composition: Thin Film; Number of Terminations: 2; Voltage Rating (DC): 50V; Max Power Dissipation: 100mW; Military Standard: Not; Features: Moisture Resistant,Automotive AEC-Q200,Anti-Sulfur; Depth: 0.85mm; Radiation Hardening: No; Lead Free: Lead Free; REACH SVHC: Unknown; ComponentLink3URL: https://datasheet.ciiva.com/16780/70201627-16780423.pdf?src-supplier=Allied+Electronics; ComponentLink3Description: https://datasheet.ciiva.com/16780/70201627-16780423.pdf?src-supplier=Allied+Electronics; ComponentLink4URL: https://datasheet.ciiva.com/9003/tnpw-e3-9003914.pdf?src-supplier=Avnet; ComponentLink4Description: https://datasheet.ciiva.com/9003/tnpw-e3-9003914.pdf?src-supplier=Avnet; ComponentLink5URL: https://datasheet.ciiva.com/17177/tnpw-e3-17177595.pdf?src-supplier=Avnet+Europe; ComponentLink5Description: https://datasheet.ciiva.com/17177/tnpw-e3-17177595.pdf?src-supplier=Avnet+Europe; ComponentLink6URL: https://datasheet.ciiva.com/2606/tnpw-e3-2606815.pdf?src-supplier=Digi-Key; ComponentLink6Description: https://datasheet.ciiva.com/2606/tnpw-e3-2606815.pdf?src-supplier=Digi-Key; ComponentLink7URL: https://datasheet.ciiva.com/41822/tnpw-e3-41822687.pdf?src-supplier=Digi-Key; ComponentLink7Description: https://datasheet.ciiva.com/41822/tnpw-e3-41822687.pdf?src-supplier=Digi-Key; ComponentLink8URL: https://datasheet.ciiva.com/48525/tnpw-e3-48525903.pdf?src-supplier=Avnet; ComponentLink8Description: https://datasheet.ciiva.com/48525/tnpw-e3-48525903.pdf?src-supplier=Avnet
R15-R18 = RES-0402: VISHAY - CRCW060333R0FKEA. - Resistore su Chip a Mont. Superficiale, Film Spesso, 0603 [1608 Metrico], 33 ohm, Serie CRCW, 75 V; Manufacturer: Vishay Dale; Manufacturer Part Number: CRA06S04333R0JTA; Tolerance: 5%; Number of Elements: 2; Number of Contacts: 4; Voltage Rating (DC): 50V; Circuit Type: Isolated; Power Per Element: 62.5mW; Power Dissipation: 63mW; Temperature Coefficient: 200ppm/°C; Power Rating: 100mW; Voltage Rating: 75V; Supplier 1: Arrow; Supplier Part Number 1: CRA06S04333R0JTA; RoHS: Yes; Category: Resistor Arrays; Mount: Surface Mount; Case/Package: 0606; Number of Pins: 4; Case Code (Metric): 1615; Case Code (Imperial): 0605; Min Operating Temperature: -55°C; Max Operating Temperature: 155°C; Package Quantity: 5000; Resistance: 33R; Packaging: Tape and Reel; Number of Resistors: 2; Working Voltage: 50V; Length: 0.063inch; Height: 0.024inch; Width: 0.059inch; Thickness: 500um; Lead Free: Exempt; ComponentLink1URL: https://datasheet.ciiva.com/16449/cra06es-16449142.pdf?src-supplier=Future+Electronics; ComponentLink1Description: https://datasheet.ciiva.com/16449/cra06es-16449142.pdf?src-supplier=Future+Electronics; ComponentLink2URL: https://datasheet.ciiva.com/2697/cra06es-2697280.pdf?src-supplier=Digi-Key; ComponentLink2Description: https://datasheet.ciiva.com/2697/cra06es-2697280.pdf?src-supplier=Digi-Key; ComponentLink3URL: https://datasheet.ciiva.com/2697/cra06es-2697281.pdf?src-supplier=Digi-Key; ComponentLink3Description: https://datasheet.ciiva.com/2697/cra06es-2697281.pdf?src-supplier=Digi-Key; ComponentLink4URL: https://datasheet.ciiva.com/2697/cra06es-2697282.pdf?src-supplier=Digi-Key; ComponentLink4Description: https://datasheet.ciiva.com/2697/cra06es-2697282.pdf?src-supplier=Digi-Key; Supplier 2: Digi-Key; Supplier Part Number 2: 541-33.0HCT-ND; Stock 2: 43325; Pricing 2: 1=0.10000, 10=0.03300, 100=0.01340, 1000=0.00602, 2500=0.00522 (USD); Weight: 7.1E-05oz; Contact Plating: Tin; Composition: Thick Film; Number of Terminations: 2; Termination: SMD/SMT; Max Power Dissipation: 100mW; Military Standard: Not; Features: Automotive AEC-Q200; Depth: 0.85mm; Radiation Hardening: No; REACH SVHC: Unknown; ComponentLink5URL: https://datasheet.ciiva.com/11809/0900766b80d98afc-11809158.pdf?src-supplier=RSComponents; ComponentLink5Description: https://datasheet.ciiva.com/11809/0900766b80d98afc-11809158.pdf?src-supplier=RSComponents; ComponentLink6URL: https://datasheet.ciiva.com/7777/1720486-7777558.pdf?src-supplier=Element14; ComponentLink6Description: https://datasheet.ciiva.com/7777/1720486-7777558.pdf?src-supplier=Element14; ComponentLink7URL: https://datasheet.ciiva.com/7777/1697337-7777317.pdf?src-supplier=Element14; ComponentLink7Description: https://datasheet.ciiva.com/7777/1697337-7777317.pdf?src-supplier=Element14; ComponentLink8URL: https://datasheet.ciiva.com/7777/1720486-7777557.pdf?src-supplier=Element14; ComponentLink8Description: https://datasheet.ciiva.com/7777/1720486-7777557.pdf?src-supplier=Element14; ComponentLink9URL: https://datasheet.ciiva.com/2465/dcrcwe3-2465591.pdf?src-supplier=Digi-Key; ComponentLink9Description: https://datasheet.ciiva.com/2465/dcrcwe3-2465591.pdf?src-supplier=Digi-Key; ComponentLink10URL: https://datasheet.ciiva.com/2465/dcrcwe3-2465593.pdf?src-supplier=Digi-Key; ComponentLink10Description: https://datasheet.ciiva.com/2465/dcrcwe3-2465593.pdf?src-supplier=Digi-Key; ComponentLink11URL: https://datasheet.ciiva.com/16893/dcrcwe3-16893242.pdf?src-supplier=Avnet+Europe; ComponentLink11Description: https://datasheet.ciiva.com/16893/dcrcwe3-16893242.pdf?src-supplier=Avnet+Europe; ComponentLink12URL: https://datasheet.ciiva.com/16783/70201119-16783349.pdf?src-supplier=Allied+Electronics; ComponentLink12Description: https://datasheet.ciiva.com/16783/70201119-16783349.pdf?src-supplier=Allied+Electronics; ComponentLink13URL: https://datasheet.ciiva.com/16771/70201119-16771126.pdf?src-supplier=Allied+Electronics; ComponentLink13Description: https://datasheet.ciiva.com/16771/70201119-16771126.pdf?src-supplier=Allied+Electronics; ComponentLink14URL: https://datasheet.ciiva.com/2465/dcrcwe3-2465592.pdf?src-supplier=Digi-Key; ComponentLink14Description: https://datasheet.ciiva.com/2465/dcrcwe3-2465592.pdf?src-supplier=Digi-Key
R19 = RES-0402: Thick Film Chip Resistor; Manufacturer: Vishay Dale; Manufacturer Part Number: CRA06S0431M00JTA; Number of Contacts: 4; Voltage Rating (DC): 50V; Temperature Coefficient: 200ppm/°C; Circuit Type: Isolated; Number of Resistors: 2; Power Per Element: 62.5mW; Resistance: 1MR; Tolerance: 5%; Power Rating: 100mW; Voltage Rating: 75V; Supplier 1: Avnet; Supplier Part Number 1: CRA06S0431M00JTA; RoHS: Yes; Category: Resistor Arrays; Mount: Surface Mount; Case/Package: Molded; Number of Pins: 4; Contact Plating: Tin; Case Code (Metric): 1615; Case Code (Imperial): 0605; Min Operating Temperature: -55°C; Max Operating Temperature: 155°C; Termination: Convex; Package Quantity: 5000; Packaging: Tape and Reel; Length: 0.063inch; Height: 0.024inch; Terminal Pitch: 0.8mm; Thickness: 500um; Width: 0.059inch; Lead Free: Exempt; ComponentLink1URL: https://datasheet.ciiva.com/2697/cra06es-2697253.pdf?src-supplier=Digi-Key; ComponentLink1Description: https://datasheet.ciiva.com/2697/cra06es-2697253.pdf?src-supplier=Digi-Key; ComponentLink2URL: https://datasheet.ciiva.com/2697/cra06es-2697254.pdf?src-supplier=Digi-Key; ComponentLink2Description: https://datasheet.ciiva.com/2697/cra06es-2697254.pdf?src-supplier=Digi-Key; ComponentLink3URL: https://datasheet.ciiva.com/2697/cra06es-2697255.pdf?src-supplier=Digi-Key; ComponentLink3Description: https://datasheet.ciiva.com/2697/cra06es-2697255.pdf?src-supplier=Digi-Key; ComponentLink4URL: https://datasheet.ciiva.com/8318/cra06es-8318619.pdf?src-supplier=Avnet; ComponentLink4Description: https://datasheet.ciiva.com/8318/cra06es-8318619.pdf?src-supplier=Avnet; Supplier 2: Digi-Key; Supplier Part Number 2: 541-1.00MHDKR-ND; Stock 2: 89695; Pricing 2: 1=0.10000, 10=0.03400, 100=0.01390, 1000=0.00623, 2500=0.00540 (USD); Weight: 7.1E-05oz; Composition: Thick Film; Number of Terminations: 2; Max Power Dissipation: 100mW; Military Standard: Not; Features: Automotive AEC-Q200; Depth: 0.85mm; Radiation Hardening: No; REACH SVHC: Unknown; ComponentLink5URL: https://datasheet.ciiva.com/11809/0900766b80d98afc-11809074.pdf?src-supplier=RSComponents; ComponentLink5Description: https://datasheet.ciiva.com/11809/0900766b80d98afc-11809074.pdf?src-supplier=RSComponents; ComponentLink6URL: https://datasheet.ciiva.com/16311/dcrcwe3-16311533.pdf?src-supplier=Future+Electronics; ComponentLink6Description: https://datasheet.ciiva.com/16311/dcrcwe3-16311533.pdf?src-supplier=Future+Electronics; ComponentLink7URL: https://datasheet.ciiva.com/7841/125364-7841823.pdf?src-supplier=Element14; ComponentLink7Description: https://datasheet.ciiva.com/7841/125364-7841823.pdf?src-supplier=Element14; ComponentLink8URL: https://datasheet.ciiva.com/26314/fld-crcw-e3-data-en-26314645.pdf?src-supplier=Distrelec; ComponentLink8Description: https://datasheet.ciiva.com/26314/fld-crcw-e3-data-en-26314645.pdf?src-supplier=Distrelec; ComponentLink9URL: https://datasheet.ciiva.com/2465/dcrcwe3-2465549.pdf?src-supplier=Digi-Key; ComponentLink9Description: https://datasheet.ciiva.com/2465/dcrcwe3-2465549.pdf?src-supplier=Digi-Key; ComponentLink10URL: https://datasheet.ciiva.com/2465/dcrcwe3-2465550.pdf?src-supplier=Digi-Key; ComponentLink10Description: https://datasheet.ciiva.com/2465/dcrcwe3-2465550.pdf?src-supplier=Digi-Key; ComponentLink11URL: https://datasheet.ciiva.com/7841/1720486-7841822.pdf?src-supplier=Element14; ComponentLink11Description: https://datasheet.ciiva.com/7841/1720486-7841822.pdf?src-supplier=Element14; ComponentLink12URL: https://datasheet.ciiva.com/2465/dcrcwe3-2465551.pdf?src-supplier=Digi-Key; ComponentLink12Description: https://datasheet.ciiva.com/2465/dcrcwe3-2465551.pdf?src-supplier=Digi-Key
R20 = RES-0402: Resistor SMD 0 Ohm 0603 PU=5000 ST, CRCW06030000Z0EA, Vishay; Manufacturer Part Number: CRCW0603-0000Z0EA; Resistance: 0mR; Power Rating: 100mW; Voltage Rating: 75V; Temperature Coefficient: 100ppm/°C; Tolerance: 5%; Current Rating: 2A; Supplier 1: Allied Electronics; Supplier Part Number 1: 70202889; Manufacturer: Vishay; RoHS: Yes; Category: Chip SMD Resistors; Mount: Surface Mount; Case/Package: 0603; Weight: 7.1E-05oz; Case Code (Metric): 1608; Case Code (Imperial): 0603; Contact Plating: Tin,Lead; Min Operating Temperature: -55°C; Max Operating Temperature: 155°C; Packaging: Tape and Reel; Composition: Thick Film; Voltage Rating (DC): 75V; Military Standard: Not; Package Quantity: 1; Termination: SMD/SMT; Max Power Dissipation: 100mW; Number of Terminations: 2; Features: Automotive AEC-Q200; Working Voltage: 75V; Length: 1.55mm; Height: 0.02inch; Width: 0.033inch; Depth: 0.85mm; Radiation Hardening: No; REACH SVHC: Unknown; Lead Free: Lead Free; ComponentLink1URL: https://datasheet.ciiva.com/2461/dcrcwe3-2461968.pdf?src-supplier=Digi-Key; ComponentLink1Description: https://datasheet.ciiva.com/2461/dcrcwe3-2461968.pdf?src-supplier=Digi-Key; ComponentLink2URL: https://datasheet.ciiva.com/5544/dcrcwe3-109170-5544344.pdf?src-supplier=Mouser; ComponentLink2Description: https://datasheet.ciiva.com/5544/dcrcwe3-109170-5544344.pdf?src-supplier=Mouser; ComponentLink3URL: https://datasheet.ciiva.com/2461/dcrcwe3-2461969.pdf?src-supplier=Digi-Key; ComponentLink3Description: https://datasheet.ciiva.com/2461/dcrcwe3-2461969.pdf?src-supplier=Digi-Key; ComponentLink4URL: https://datasheet.ciiva.com/2461/dcrcwe3-2461970.pdf?src-supplier=Digi-Key; ComponentLink4Description: https://datasheet.ciiva.com/2461/dcrcwe3-2461970.pdf?src-supplier=Digi-Key; ComponentLink5URL: https://datasheet.ciiva.com/8340/dcrcwe3-8340197.pdf?src-supplier=Avnet; ComponentLink5Description: https://datasheet.ciiva.com/8340/dcrcwe3-8340197.pdf?src-supplier=Avnet; ComponentLink6URL: https://datasheet.ciiva.com/16941/dcrcw-16941302.pdf?src-supplier=Avnet+Europe; ComponentLink6Description: https://datasheet.ciiva.com/16941/dcrcw-16941302.pdf?src-supplier=Avnet+Europe; ComponentLink7URL: https://datasheet.ciiva.com/16199/dcrcwe3-16199063.pdf?src-supplier=Future+Electronics; ComponentLink7Description: https://datasheet.ciiva.com/16199/dcrcwe3-16199063.pdf?src-supplier=Future+Electronics; ComponentLink8URL: https://datasheet.ciiva.com/16725/70201119-16725175.pdf?src-supplier=Allied+Electronics; ComponentLink8Description: https://datasheet.ciiva.com/16725/70201119-16725175.pdf?src-supplier=Allied+Electronics; ComponentLink9URL: https://datasheet.ciiva.com/26316/fld-crcw-e3-data-en-26316615.pdf?src-supplier=Distrelec; ComponentLink9Description: https://datasheet.ciiva.com/26316/fld-crcw-e3-data-en-26316615.pdf?src-supplier=Distrelec; ComponentLink10URL: https://datasheet.ciiva.com/7841/1720486-7841816.pdf?src-supplier=Element14; ComponentLink10Description: https://datasheet.ciiva.com/7841/1720486-7841816.pdf?src-supplier=Element14; ComponentLink11URL: https://datasheet.ciiva.com/7841/1720486-7841817.pdf?src-supplier=Element14; ComponentLink11Description: https://datasheet.ciiva.com/7841/1720486-7841817.pdf?src-supplier=Element14; ComponentLink12URL: https://datasheet.ciiva.com/7841/125364-7841818.pdf?src-supplier=Element14; ComponentLink12Description: https://datasheet.ciiva.com/7841/125364-7841818.pdf?src-supplier=Element14; ComponentLink13URL: https://datasheet.ciiva.com/16721/70201119-16721450.pdf?src-supplier=Allied+Electronics; ComponentLink13Description: https://datasheet.ciiva.com/16721/70201119-16721450.pdf?src-supplier=Allied+Electronics